# Altium project PCB_Project.PrjPcb
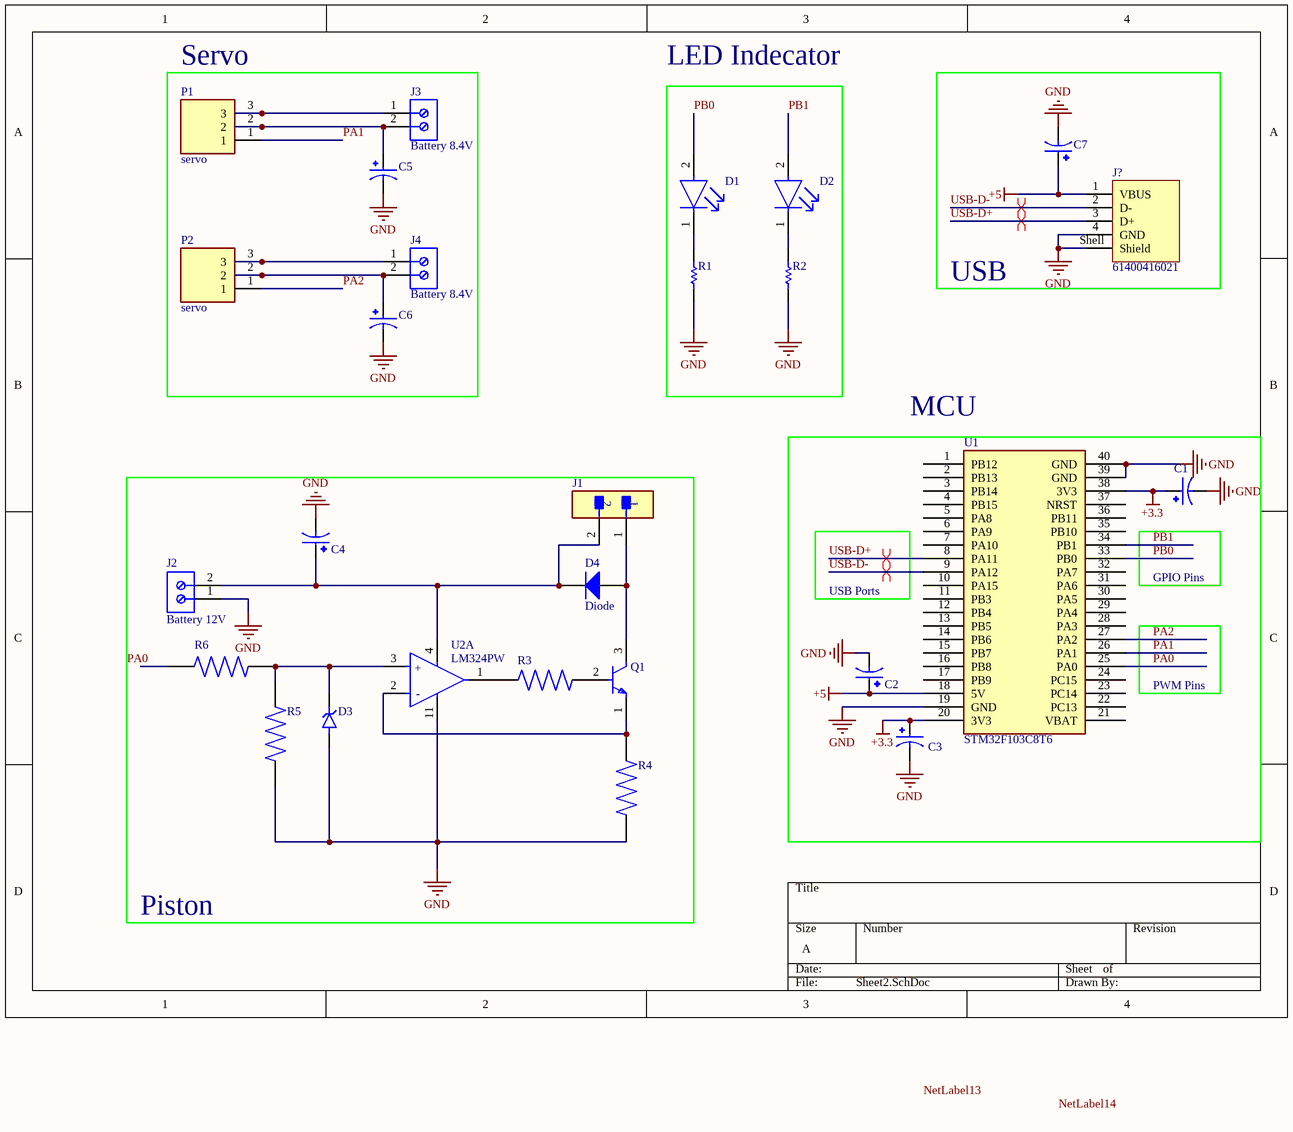
[diagram p0: Sheet2.SchDoc]
Date: 8/29/2024; Designer: Mahmoud Sameh; Project: Intro to Altium
1 sheet, 27 parts. Net scope: global (net labels, ports and power ports of the same name join across sheets).
Board file: PCB1.PcbDoc

## Sheet Sheet2.SchDoc
size A; SheetNumber: 1; SheetTotal: 1; SPICEModelCacheJZVMWNHF: <root> / <DocumentId>JZVMWNHF</DocumentId> / <CacheFrame Number="0"> / <Model Name="diode" Kind="MDL"> / <Text>*Default Diode / *Diode Pinout: A,K / .MODEL DIODE D()</Text> / </Model> / </CacheFrame> / </root>

### Parts
C1  EEE1EA470WP  [CAP_EEE1EA470WP]  (value not drawn)
C2  EEE1EA470WP  [CAP_EEE1EA470WP]  (value not drawn)
C3  EEE1EA470WP  [CAP_EEE1EA470WP]  (value not drawn)
C4  EEE1EA470WP  [CAP_EEE1EA470WP]  (value not drawn)
C5  EEE1EA470WP  [CAP_EEE1EA470WP]  (value not drawn)
C6  EEE1EA470WP  [CAP_EEE1EA470WP]  (value not drawn)
C7  EEE1EA470WP  [CAP_EEE1EA470WP]  (value not drawn)
D1  LTST-C190GKT  [FP-LTST-C190GKT-MFG]  (value not drawn)
D2  LTST-C190GKT  [FP-LTST-C190GKT-MFG]  (value not drawn)
D3  1N4760A  [DIOAD1060W70L435D230]  (value not drawn)
D4  Diode  [SMC]
J1  837-22-002-30-001101  [FP-837-22-002-30-001101-MFG]  (value not drawn)
J2  Battery 12V  [691103110002]
J3  Battery 8.4V  [691103110002]
J4  Battery 8.4V  [691103110002]
J?  61400416021  [61400416021]
P1  servo  [CUI_TB009-508-03BE]
P2  servo  [CUI_TB009-508-03BE]
Q1  SS8050DBU  [FP-135AN-MFG]  (value not drawn)
R1  ERJ-8GEY0R00V  [RESC3216X70X50NL05T20]  (value not drawn)
R2  ERJ-8GEY0R00V  [RESC3216X70X50NL05T20]  (value not drawn)
R3  RNC55H3300BSRE6  [RESAD1081W64L635D269]  (value not drawn)
R4  RNC55H3300BSRE6  [RESAD1081W64L635D269]  (value not drawn)
R5  RNC55H3300BSRE6  [RESAD1081W64L635D269]  (value not drawn)
R6  RNC55H3300BSRE6  [RESAD1081W64L635D269]  (value not drawn)
U1  STM32F103C8T6  [Stm32 BluePill]
U2  LM324PW  [FP-PW0014A-MFG]  (part A of 4)

### Blocks framed on the sheet
Servo: C5 C6 J3 J4 P1 P2
USB: C7 J?
LED Indecator: D1 D2 R1 R2
MCU: C1-C3 U1
Piston: C4 D3 D4 J1 J2 Q1 R3-R6 U2

### Nets
+3.3: C1.1 C3.1 U1.20(3V3) U1.38(3V3)
+5: C2.1 C7.1 J?.1(VBUS) U1.18(5V)
GND: C1.2 C2.2 C3.2 C4.2 C5.2 C6.2 C7.2 D3.A J2.1 J?.4(GND) J?.Shell(Shield) R1.1 R2.1 R4.1 R5.1 U1.19(GND) U1.39(GND) U1.40(GND) U2.11(GND)
PA0: U1.25(PA0)
PA1: P1.1 U1.26(PA1)
PA2: P2.1 U1.27(PA2)
PB0: D1.2(A) U1.33(PB0)
PB1: D2.2(A) U1.34(PB1)
USB-D+: J?.3(D+) U1.8(PA11)
USB-D-: J?.2(D-) U1.9(PA12)
NetC4_1: C4.1 D4.2(K) J1.2 J2.2 U2.4(VCC)
NetC5_1: C5.1 J3.2 P1.2
NetC6_1: C6.1 J4.2 P2.2
NetD1_1: D1.1(C) R1.2
NetD2_1: D2.1(C) R2.2
NetD3_C: D3.C(K) R5.2 R6.2 U2.3(1IN+)
NetD4_1: D4.1(A) J1.1 Q1.3(C)
NetJ3_1: J3.1 P1.3
NetJ4_1: J4.1 P2.3
NetQ1_1: Q1.1(E) R4.2 U2.2(1IN-)
NetR3_1: R3.1 U2.1(1OUT)

Not connected (* = marked no-connect by the designer): Q1 2(B); R3 2; R6 1; U1 1(PB12) 2(PB13) 3(PB14) 4(PB15) 5(PA8) 6(PA9) 7(PA10) 10(PA15) 11(PB3) 12(PB4) 13(PB5) 14(PB6) 15(PB7) 16(PB8) 17(PB9) 21(VBAT) 22(PC13) 23(PC14) 24(PC15) 28(PA3) 29(PA4) 30(PA5) 31(PA6) 32(PA7) 35(PB10) 36(PB11) 37(NRST)

### Layout directives
differential pair: USB-D+, USB-D-

### Notes on the sheet
- USB Ports
- GPIO Pins
- PWM Pins
- Labels drawn without touching a wire or pin: NetLabel13, NetLabel14, PA0
- (in symbol CMP-04895-000008-1, part A) +; -

### Library data of the parts
C1-C7 = EEE1EA470WP: 47ÂµF 25V Aluminum Electrolytic Capacitors Radial, Can - SMD 1000 Hrs @ 85Â°C; MP: EEE-1EA470WP; MF: Panasonic Electronic; SnapEDA_Link: https://www.snapeda.com/parts/EEE-1EA470WP/Panasonic%20Electronic%20Components/view-part/286288/?ref=snap; Availability: In Stock; Value: *; Price: None; Package: RADIAL-2 Panasonic; Check_prices: https://www.snapeda.com/parts/EEE-1EA470WP/Panasonic%20Electronic%20Components/view-part/286288/?ref=eda
D1 D2 = CMP-22017-000005-2: LED GREEN CLEAR CHIP SMD; Dominant Wavelength: 569nm; Reverse Voltage: 5V; Lens Color: Colorless; Viewing Angle: 130°; Voltage: 2V; Forward Current: 30mA; Power Dissipation: 100mW; Luminous Intensity: 6mcd; Number of LEDs: 1; Forward Voltage: 2.1V; Wavelength: 565nm; Test Current: 10mA; Min Operating Temperature: -55°C; Lens Style: Clear; Mount: Surface Mount; Width: 0.8mm; Packaging: Tape and Reel; Lens Transparency: Clear; Case Code (Metric): 1608; Depth: 0.8mm; Case Code (Imperial): 0603; Case/Package: 0603; Number of Pins: 2; Max Operating Temperature: 85°C; Lead Free: Lead Free; Number of Elements: 1; Length: 1.6mm; Height: 0.8mm; Package Quantity: 1; Power Rating: 100mW; Radiation Hardening: No; Illumination Color: Green; Color: Green
D3 = 1N4760A: DO-204AL (DO-41), 1000mW, 5%, Zener Diode; MF: Taiwan Semiconductor; SnapEDA_Link: https://www.snapeda.com/parts/1N4760A/Taiwan+Semiconductor/view-part/?ref=snap; Package: DO-41-2 Taiwan Semiconductor; Value: *; MP: 1N4760A; Check_prices: https://www.snapeda.com/parts/1N4760A/Taiwan+Semiconductor/view-part/?ref=eda
D4 = Diode: Default Diode; Published: 8-Jun-2000; LatestRevisionDate: 17-Jul-2002; LatestRevisionNote: Re-released for DXP Platform.; PackageVersion: Sep-1996; PackageReference: SMC; Publisher: Altium Limited; PackageDescription: DO-214-AB/SMC; 2 C-Bend Leads; Body 7.9 x 5.9 mm, inc. leads (LxW); Code_JEDEC: DO-214-AB
J1 = CMP-07791-000013-1: CONN SPRING PISTON 2POS SMD; Manufacturer: Mill-Max; Pitch: 2.54mm; Current Rating: 2A; Standoff Height: 0.41mm; Conn Orientation: Vertical; Description: 2 Position Spring Piston Connector Surface Mount; Conn Gender: Male; Voltage Rating: 150V; Number Of Contacts: 2; Contact Material: Gold,Nickel; Package: 837-22-002-30-001101; ComponentLink2URL: https://www.mill-max.com/catalog/download/2019-08%3A009.1M.pdf; Device Class L1: Connectors; Height: 9.63mm; RoHS: TRUE; Device Class L2: Headers and Wire Housings; Digikey Description: CONN SPRING PISTON 2POS SMD; Number Of Rows: 1; Device Class L3: unset; Octopart: https://octopart.com/837-22-002-30-001101-mill-max-76383858; ComponentLink2Description: Datasheet; Automotive: No; Lead Free: No; Manufacturer Part Number: 837-22-002-30-001101; Category: Conn
J2-J4 = CMP-1502-03254-2: NexarPartId: 18818286; Pitch: 3.5052mm; Current Rating: 10A; Number of Positions Per Level: 2; Plating: Steel; Number of Levels: 1; Voltage: 125V; Wire/Cable Gauge: 26AWG; Stripping Length: -6mm; Wire Gauge (Min): 16AWG; Packaging: Box; Number of Rows: 1; Color: Blue; Height: 8.5mm; Current: 10A; Lead Pitch: 3.5mm; RoHS: Compliant; Housing Material: Nylon; Width: 8mm; Length: 7mm; Contact Plating: Tin; Number of Pins: 2; Mount: Through Hole; Min Operating Temperature: -40°C; Number of Contacts: 2; REACH SVHC: Unknown; Termination: Screw; Wire Gauge (Max): 26AWG; Max Operating Temperature: 105°C; Voltage Rating: 125V; Contact Material: Brass, Copper, Nickel, Tin, Zinc
J? = CMP-1502-03227-2: NexarPartId: 21041530; Contact Resistance: 20mΩ; Gender: Receptacle; Voltage Rating (DC): 30V; Current Rating: 1.5A; Connector Type: USB; Insulation Resistance: 1GΩ; USB Standard: USB 2.0; Number of Contacts: 4; Number of Ports: 1; Width: 14.4mm; REACH SVHC: Unknown; Contact Plating: Gold; Length: 15.8mm; Lead Free: Lead Free; Max Operating Temperature: 105°C; Orientation: Horizontal; Contact Material: Copper; Voltage Rating: 30V; Min Operating Temperature: -40°C; Flammability Rating: UL94 V-0; Color: White; RoHS: Compliant; Number of Pins: 4; Mount: Horizontal, Through Hole; Number of Positions: 4; Operating Supply Voltage: 30V; Insulation Material: PBT; Termination: Solder
P1 P2 = TB009-508-03BE: 2~24 Poles, Screw Type, Horizontal, 5.08 Pitch, 26~12 (AWG), Terminal Block Connector; MF: CUI Devices; Price: None; SnapEDA_Link: https://www.snapeda.com/parts/TB009-508-03BE/CUI+Devices/view-part/?ref=snap; CUI_purchase_URL: https://www.cuidevices.com/product/interconnect/connectors/terminal-blocks/tb009-508-series?utm_source=snapeda.com&utm_medium=referral&utm_campaign=snapedaBOM; Purchase-URL: https://pricing.snapeda.com/search/part/TB009-508-03BE/?ref=eda; Availability: In Stock; MP: TB009-508-03BE; Package: None; Check_prices: https://www.snapeda.com/parts/TB009-508-03BE/CUI+Devices/view-part/?ref=eda; Value: *
Q1 = CMP-00278-84331634-1: SS8050DBU Bipolar (BJT) Single Transistor, NPN, 25 V, 100 MHz, 1 W, 1.5 A, 160; Manufacturer Lifecycle Status: ACTIVE; Collector Base Voltage (VCBO): 40V; Power Dissipation: 1W; Max Junction Temperature (Tj): 150°C; Frequency: 100MHz; Output Power: 2W; Collector Emitter Voltage (VCEO): 25V; Max Collector Current: 1.5A; Collector Emitter Saturation Voltage: 500mV; Number of Elements: 1; Emitter Base Voltage (VEBO): 6V; hFE Min: 85; RoHS: Compliant; Lifecycle Status: Production; Lead Free: Lead Free; Transition Frequency: 100MHz; Case/Package: TO-92; Width: 3.86mm; Min Operating Temperature: -65°C; Element Configuration: Single; Gain Bandwidth Product: 100MHz; REACH SVHC: No SVHC; Max Frequency: 100MHz; Radiation Hardening: No; Current Rating: 1.5A; Mount: Through Hole; Max Operating Temperature: 150°C; Polarity: NPN; Number of Pins: 3; Collector Emitter Breakdown Voltage: 25V; Schedule B: 8541290080, 8541290080; Packaging: Bulk; Weight: 179mg; NexarPartId: 84331634; Voltage Rating (DC): 25V; Max Power Dissipation: 1W; Height: 4.58mm; Length: 4.58mm
R1 R2 = CMP-2003-00541-1: Manufacturer: Panasonic; Part Number: ERJ-8GEY0R00V
R3-R6 = RNC55H3300BSRE6: 330 Ohms Â±0.1% 0.125W, 1/8W Through Hole Resistor Axial Military, Moisture Resistant, Weldable Metal Film; MF: Vishay; SnapEDA_Link: https://www.snapeda.com/parts/RNC55H3300BSRE6/Vishay/view-part/?ref=snap; Package: erc55 Vishay; Value: *; MP: RNC55H3300BSRE6; Check_prices: https://www.snapeda.com/parts/RNC55H3300BSRE6/Vishay/view-part/?ref=eda
U1 = BluePill: Designed By @Alixahedi
U2 = CMP-04895-000008-1: IC OPAMP GP 4 CIRCUIT 14TSSOP; Manufacturer: Texas Instruments; Number Of Channels: 4; Input Offset Voltage: 3mV; Output Current Per Channel: 20mA; Input Bias Current: -0.02uA; Min Supply Voltage: 3V; Standoff Height: 0.05mm; Max Dual Supply Voltage: 16V; Max Junction Temp: +150°C; Min Dual Supply Voltage: 1.5V; Max Supply Voltage: 32V; Nominal Supply Current: 0.7-1.4mA; Gain Bandwidth: 1.2MHz; Description: IC OPAMP GP 1.2MHZ 14TSSOP; Voltage Gain: 100V/mV; Manufacturer Part Number: LM324PW; RoHS: TRUE; Temperature Range Low: 0°C; Lead Free: Yes; Height: 1.2mm; Ambient Temperature Range High: +70°C; Mouser Description: Operational Amplifiers - Op Amps Quad General-Purpose Op Amp; Temperature: 0°C to +70°C; Category: IC; Ipc Land Pattern Name: SOP65P640X120-14; Octopart: https://octopart.com/lm324pw-texas+instruments-1176274; ComponentLink2URL: http://www.ti.com/lit/ds/symlink/lm324.pdf; Automotive: No; Package: PW0014A; Digikey Description: IC OPAMP GP 4 CIRCUIT 14TSSOP; Device Class L1: Integrated Circuits (ICs); Temperature Range High: +70°C; Device Class L3: Amplifiers - Op Amps; ComponentLink2Description: Datasheet; Ambient Temperature Range Low: 0°C; Device Class L2: Linear ICs